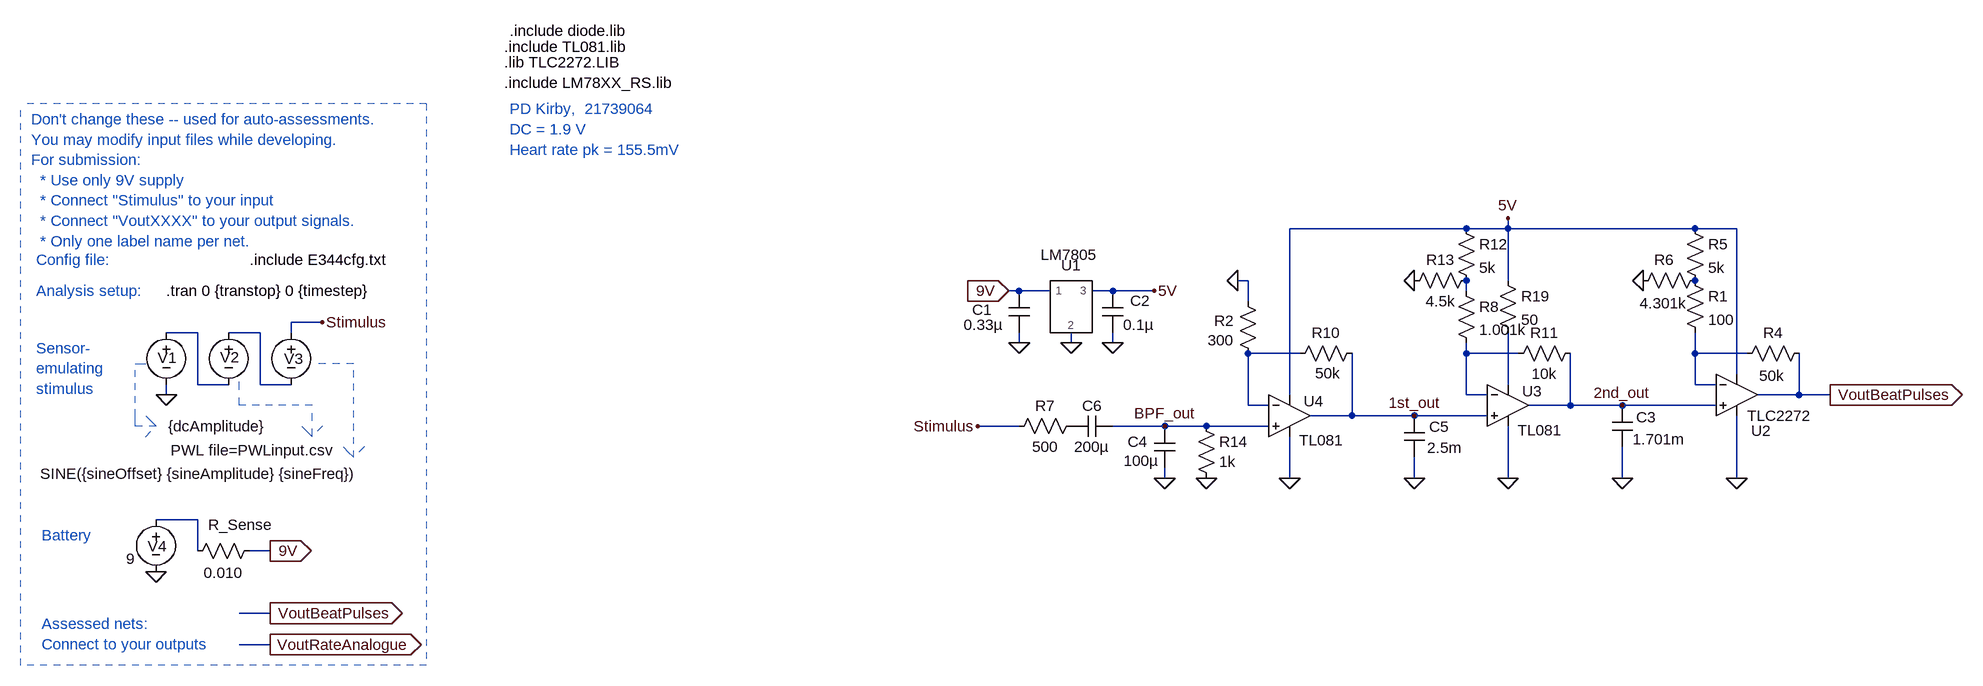
[diagram p0: schematic Kirby_21739064_A2.asc]
Kirby_21739064_A2.asc, the LTspice schematic file:
Version 4
SHEET 1 2276 680
WIRE -80 -1216 -352 -1216
WIRE -16 -1216 -16 -1232
WIRE -16 -1216 -80 -1216
WIRE 272 -1216 -16 -1216
WIRE 336 -1216 272 -1216
WIRE -416 -1136 -432 -1136
WIRE -16 -1136 -16 -1216
WIRE -768 -1120 -784 -1120
WIRE -720 -1120 -768 -1120
WIRE -624 -1120 -656 -1120
WIRE -560 -1120 -624 -1120
WIRE -80 -1120 -80 -1136
WIRE -416 -1104 -416 -1136
WIRE -1840 -1072 -1888 -1072
WIRE -2032 -1056 -2080 -1056
WIRE -1936 -1056 -1984 -1056
WIRE -1888 -1056 -1888 -1072
WIRE -768 -1040 -768 -1056
WIRE -688 -1040 -688 -1056
WIRE -624 -1040 -624 -1056
WIRE -336 -1024 -416 -1024
WIRE -80 -1024 -80 -1040
WIRE 0 -1024 -80 -1024
WIRE 272 -1024 272 -1056
WIRE 352 -1024 272 -1024
WIRE 336 -992 336 -1216
WIRE -2032 -976 -2032 -1056
WIRE -1984 -976 -2032 -976
WIRE -1936 -976 -1936 -1056
WIRE -1888 -976 -1936 -976
WIRE -16 -976 -16 -1056
WIRE 272 -976 272 -1024
WIRE 304 -976 272 -976
WIRE -2080 -960 -2080 -976
WIRE -352 -960 -352 -1216
WIRE -80 -960 -80 -1024
WIRE -48 -960 -80 -960
WIRE 432 -960 432 -1024
WIRE 432 -960 368 -960
WIRE 480 -960 432 -960
WIRE -416 -944 -416 -1024
WIRE -384 -944 -416 -944
WIRE 80 -944 80 -1024
WIRE 80 -944 16 -944
WIRE 160 -944 80 -944
WIRE 304 -944 160 -944
WIRE -256 -928 -256 -1024
WIRE -256 -928 -320 -928
WIRE -160 -928 -256 -928
WIRE -48 -928 -160 -928
WIRE -768 -912 -832 -912
WIRE -544 -912 -624 -912
WIRE -480 -912 -544 -912
WIRE -384 -912 -480 -912
WIRE -544 -832 -544 -848
WIRE -352 -832 -352 -896
WIRE -160 -832 -160 -864
WIRE -16 -832 -16 -912
WIRE 160 -832 160 -880
WIRE 336 -832 336 -928
WIRE -2032 -768 -2096 -768
WIRE -2032 -720 -2032 -768
WIRE -1920 -720 -1952 -720
WIRE -1920 -624 -1968 -624
WIRE -1920 -576 -1968 -576
FLAG -2080 -960 0
FLAG -1840 -1072 Stimulus
FLAG -1920 -720 9V
IOPIN -1920 -720 Out
FLAG -2096 -688 0
FLAG -784 -1120 9V
IOPIN -784 -1120 In
FLAG -1920 -624 VoutBeatPulses
IOPIN -1920 -624 Out
FLAG -1920 -576 VoutRateAnalogue
IOPIN -1920 -576 Out
FLAG -688 -1040 0
FLAG -624 -1040 0
FLAG -768 -1040 0
FLAG -352 -832 0
FLAG -432 -1136 0
FLAG -832 -912 Stimulus
FLAG -560 -1120 5V
FLAG 336 -832 0
FLAG 192 -1136 0
FLAG 480 -960 VoutBeatPulses
IOPIN 480 -960 Out
FLAG -16 -832 0
FLAG -160 -1136 0
FLAG -544 -832 0
FLAG 160 -832 0
FLAG -160 -832 0
FLAG -480 -832 0
FLAG -16 -1232 5V
FLAG -544 -912 BPF_out
FLAG -160 -928 1st_out
FLAG 160 -944 2nd_out
SYMBOL voltage -1984 -1072 R0
WINDOW 123 0 0 Left 0
WINDOW 39 0 0 Left 0
WINDOW 3 -89 197 Left 2
WINDOW 0 -13 54 Left 2
SYMATTR Value PWL file=PWLinput.csv
SYMATTR InstName V2
SYMBOL voltage -1888 -1072 R0
WINDOW 123 24 44 Left 2
WINDOW 39 0 0 Left 0
WINDOW 3 -386 233 Left 2
WINDOW 0 -11 56 Left 2
SYMATTR Value SINE({sineOffset} {sineAmplitude} {sineFreq})
SYMATTR InstName V3
SYMBOL voltage -2080 -1072 R0
WINDOW 123 0 0 Left 0
WINDOW 39 0 0 Left 0
WINDOW 3 3 160 Left 2
WINDOW 0 -13 55 Left 2
SYMATTR Value {dcAmplitude}
SYMATTR InstName V1
SYMBOL voltage -2096 -784 R0
WINDOW 123 24 44 Left 2
WINDOW 39 0 0 Left 0
WINDOW 3 -46 76 Left 2
WINDOW 0 -13 57 Left 2
SYMATTR Value 9
SYMATTR InstName V4
SYMBOL res -1936 -736 R90
WINDOW 0 -9 30 VBottom 2
WINDOW 3 34 56 VTop 2
SYMATTR InstName R_Sense
SYMATTR Value 0.010
SYMBOL LM7805 -688 -1104 R0
SYMATTR InstName U1
SYMBOL cap -784 -1120 R0
WINDOW 0 -56 29 Left 2
WINDOW 3 -69 52 Left 2
SYMATTR InstName C1
SYMATTR Value 0.33µ
SYMBOL cap -640 -1120 R0
WINDOW 0 43 15 Left 2
WINDOW 3 32 52 Left 2
SYMATTR InstName C2
SYMATTR Value 0.1µ
SYMBOL Opamps\\opamp2 -352 -992 R0
WINDOW 0 22 42 Left 2
WINDOW 3 15 102 Left 2
SYMATTR InstName U4
SYMATTR Value TL081
SYMBOL res -240 -1040 R90
WINDOW 0 0 56 VBottom 2
WINDOW 3 31 53 VTop 2
SYMATTR InstName R10
SYMATTR Value 50k
SYMBOL Opamps\\opamp2 336 -1024 R0
WINDOW 0 22 119 Left 2
SYMATTR InstName U2
SYMATTR Value TLC2272
SYMBOL res 256 -1152 R0
SYMATTR InstName R1
SYMATTR Value 100
SYMBOL res 448 -1040 R90
WINDOW 0 0 56 VBottom 2
WINDOW 3 35 58 VTop 2
SYMATTR InstName R4
SYMATTR Value 50k
SYMBOL res 256 -1232 R0
SYMATTR InstName R5
SYMATTR Value 5k
SYMBOL res 288 -1152 R90
WINDOW 0 0 64 VBottom 2
WINDOW 3 35 65 VTop 2
SYMATTR InstName R6
SYMATTR Value 4.301k
SYMBOL res -96 -1136 R0
SYMATTR InstName R8
SYMATTR Value 1.001k
SYMBOL res 96 -1040 R90
WINDOW 0 0 56 VBottom 2
WINDOW 3 32 56 VTop 2
SYMATTR InstName R11
SYMATTR Value 10k
SYMBOL res -96 -1232 R0
SYMATTR InstName R12
SYMATTR Value 5k
SYMBOL res -64 -1152 R90
WINDOW 0 0 56 VBottom 2
WINDOW 3 32 56 VTop 2
SYMATTR InstName R13
SYMATTR Value 4.5k
SYMBOL cap -528 -848 R180
WINDOW 0 42 40 Left 2
WINDOW 3 25 11 Left 2
SYMATTR InstName C4
SYMATTR Value 100µ
SYMBOL cap 144 -944 R0
WINDOW 0 37 18 Left 2
WINDOW 3 32 52 Left 2
SYMATTR InstName C3
SYMATTR Value 1.701m
SYMBOL cap -624 -928 R90
WINDOW 0 0 32 VBottom 2
WINDOW 3 32 32 VTop 2
SYMATTR InstName C6
SYMATTR Value 200µ
SYMBOL res -496 -928 R0
WINDOW 3 36 71 Left 2
SYMATTR Value 1k
SYMATTR InstName R14
SYMBOL res -672 -928 R90
WINDOW 0 0 56 VBottom 2
WINDOW 3 32 56 VTop 2
SYMATTR InstName R7
SYMATTR Value 500
SYMBOL res -432 -1120 R0
WINDOW 0 -36 46 Left 2
WINDOW 3 -46 76 Left 2
SYMATTR InstName R2
SYMATTR Value 300
SYMBOL cap -176 -928 R0
WINDOW 0 39 17 Left 2
WINDOW 3 36 49 Left 2
SYMATTR InstName C5
SYMATTR Value 2.5m
SYMBOL res -32 -1152 R0
SYMATTR InstName R19
SYMATTR Value 50
SYMBOL Opamps\\opamp2 -16 -1008 R0
WINDOW 0 22 42 Left 2
WINDOW 3 15 102 Left 2
SYMATTR InstName U3
SYMATTR Value TL081
TEXT -2080 -1120 Left 2 !.tran 0 {transtop} 0 {timestep}
TEXT -1952 -1168 Left 2 !.include E344cfg.txt
TEXT -2288 -1384 Left 2 ;Don't change these -- used for auto-assessments.\nYou may modify input files while developing.\nFor submission: \n  * Use only 9V supply \n  * Connect "Stimulus" to your input\n  * Connect "VoutXXXX" to your output signals.\n  * Only one label name per net.
TEXT -2280 -1168 Left 2 ;Config file:
TEXT -2280 -1120 Left 2 ;Analysis setup:
TEXT -2272 -744 Left 2 ;Battery
TEXT -2280 -1032 Left 2 ;Sensor-\nemulating \nstimulus
TEXT -2272 -608 Left 2 ;Assessed nets:\nConnect to your outputs
TEXT -1552 -1400 Left 2 ;PD Kirby,  21739064\nDC = 1.9 V\nHeart rate pk = 155.5mV
TEXT -1560 -1496 Left 2 !.include TL081.lib
TEXT -1560 -1440 Left 2 !.include LM78XX_RS.lib
TEXT -1560 -1472 Left 2 !.lib TLC2272.LIB
TEXT -1552 -1520 Left 2 !.include diode.lib
LINE Normal -1792 -1008 -1856 -1008 2
LINE Normal -1792 -864 -1792 -1008 2
LINE Normal -1808 -880 -1792 -864 2
LINE Normal -1792 -864 -1808 -880 2
LINE Normal -1776 -880 -1792 -864 2
LINE Normal -2128 -1008 -2112 -1008 2
LINE Normal -2128 -928 -2128 -1008 2
LINE Normal -2128 -912 -2128 -928 2
LINE Normal -2096 -912 -2128 -912 2
LINE Normal -2112 -928 -2096 -912 2
LINE Normal -2096 -912 -2112 -928 2
LINE Normal -2112 -896 -2096 -912 2
LINE Normal -1968 -944 -1968 -992 2
LINE Normal -1856 -944 -1968 -944 2
LINE Normal -1856 -896 -1856 -944 2
LINE Normal -1872 -912 -1856 -896 2
LINE Normal -1856 -896 -1872 -912 2
LINE Normal -1840 -912 -1856 -896 2
LINE Normal -2304 -544 -2304 -1408 1
LINE Normal -1680 -1408 -1680 -544 1
LINE Normal -1680 -544 -2304 -544 1
LINE Normal -1680 -1408 -2304 -1408 1

The netlist it stands for:
* Kirby_21739064_A2.asc
V2 N003 N002 PWL file=PWLinput.csv
V3 Stimulus N003 SINE({sineOffset} {sineAmplitude} {sineFreq})
V1 N002 0 {dcAmplitude}
V4 N008 0 9
R_Sense 9V N008 0.010
XU1 9V 0 5V LM7805  ; pins 1 2 3
C1 9V 0 0.33µ
C2 5V 0 0.1µ
XU4 BPF_out N004 5V 0 1st_out TL081  ; pins In+ In- V+ V- OUT
R10 1st_out N004 50k
XU2 2nd_out N006 5V 0 VoutBeatPulses TLC2272  ; pins In+ In- V+ V- OUT
R1 P001 N006 100
R4 VoutBeatPulses N006 50k
R5 5V P001 5k
R6 P001 0 4.301k
R8 N001 N005 1.001k
R11 2nd_out N005 10k
R12 5V N001 5k
R13 N001 0 4.5k
C4 0 BPF_out 100µ
C3 2nd_out 0 1.701m
C6 BPF_out P002 200µ
R14 BPF_out 0 1k
R7 P002 Stimulus 500
R2 0 N004 300
C5 1st_out 0 2.5m
R19 5V N007 50
XU3 1st_out N005 N007 0 2nd_out TL081  ; pins In+ In- V+ V- OUT
.tran 0 {transtop} 0 {timestep}
.include E344cfg.txt
* Don't change these -- used for auto-assessments.
* You may modify input files while developing.
* For submission:
*   * Use only 9V supply
*   * Connect "Stimulus" to your input
*   * Connect "VoutXXXX" to your output signals.
*   * Only one label name per net.
* Config file:
* Analysis setup:
* Battery
* Sensor-
* emulating
* stimulus
* Assessed nets:
* Connect to your outputs
* PD Kirby,  21739064
* DC = 1.9 V
* Heart rate pk = 155.5mV
.include TL081.lib
.include LM78XX_RS.lib
.lib TLC2272.LIB
.include diode.lib
.lib LM78XX_RS.lib
.backanno
.end